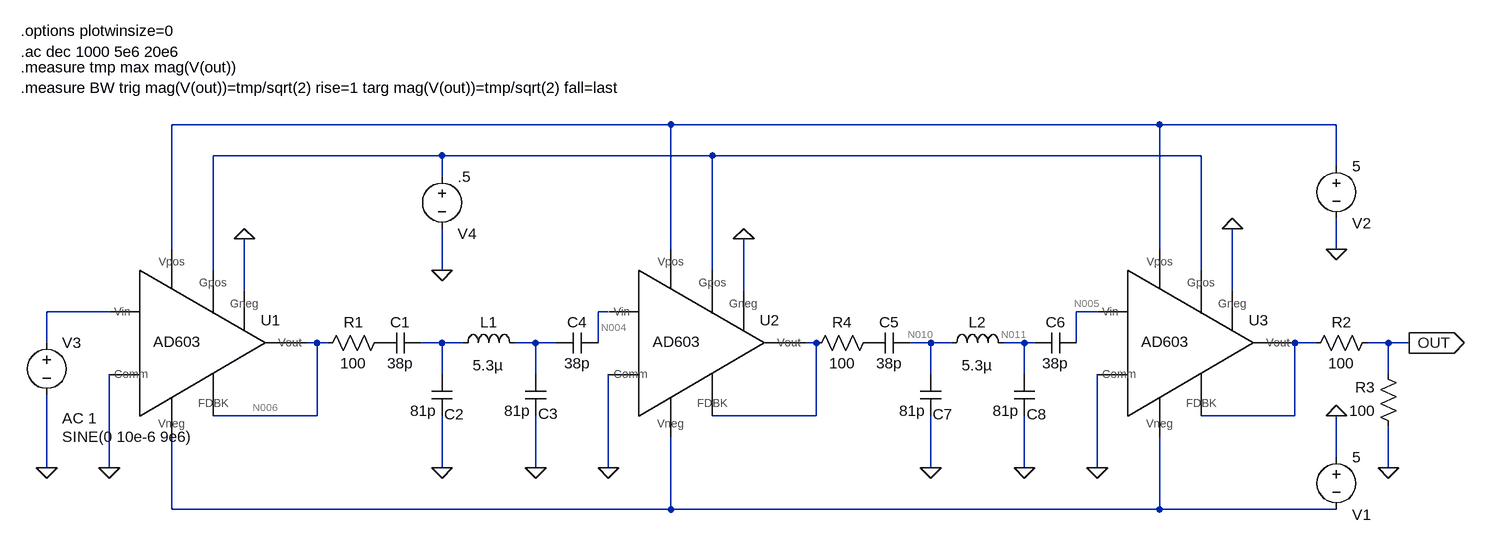
[diagram p0: schematic AD603_IF.asc]
AD603_IF.asc, the LTspice schematic file:
Version 4
SHEET 1 972 680
WIRE -1264 -352 -2032 -352
WIRE -512 -352 -1264 -352
WIRE -240 -352 -512 -352
WIRE -1616 -304 -1968 -304
WIRE -1200 -304 -1616 -304
WIRE -448 -304 -1200 -304
WIRE -240 -288 -240 -352
WIRE -1616 -272 -1616 -304
WIRE -2032 -160 -2032 -352
WIRE -1264 -160 -1264 -352
WIRE -512 -160 -512 -352
WIRE -240 -160 -240 -208
WIRE -1968 -128 -1968 -304
WIRE -1616 -128 -1616 -192
WIRE -1200 -128 -1200 -304
WIRE -448 -128 -448 -304
WIRE -1920 -96 -1920 -176
WIRE -1152 -96 -1152 -176
WIRE -400 -96 -400 -192
WIRE -2128 -64 -2224 -64
WIRE -1360 -64 -1376 -64
WIRE -608 -64 -640 -64
WIRE -2224 -16 -2224 -64
WIRE -1808 -16 -1824 -16
WIRE -1792 -16 -1808 -16
WIRE -1616 -16 -1648 -16
WIRE -1584 -16 -1616 -16
WIRE -1472 -16 -1504 -16
WIRE -1440 -16 -1472 -16
WIRE -1376 -16 -1376 -64
WIRE -1040 -16 -1056 -16
WIRE -864 -16 -896 -16
WIRE -832 -16 -864 -16
WIRE -720 -16 -752 -16
WIRE -704 -16 -720 -16
WIRE -640 -16 -640 -64
WIRE -272 -16 -304 -16
WIRE -160 -16 -192 -16
WIRE -128 -16 -160 -16
WIRE -1616 32 -1616 -16
WIRE -1472 32 -1472 -16
WIRE -864 32 -864 -16
WIRE -720 32 -720 -16
WIRE -160 32 -160 -16
WIRE -1808 96 -1808 -16
WIRE -1808 96 -1968 96
WIRE -1040 96 -1040 -16
WIRE -1040 96 -1200 96
WIRE -304 96 -304 -16
WIRE -304 96 -448 96
WIRE -240 160 -240 96
WIRE -2224 176 -2224 64
WIRE -2128 176 -2128 32
WIRE -1616 176 -1616 96
WIRE -1472 176 -1472 96
WIRE -1360 176 -1360 32
WIRE -864 176 -864 96
WIRE -720 176 -720 96
WIRE -608 176 -608 32
WIRE -160 176 -160 112
WIRE -2032 240 -2032 128
WIRE -1264 240 -1264 128
WIRE -1264 240 -2032 240
WIRE -512 240 -512 128
WIRE -512 240 -1264 240
WIRE -240 240 -512 240
FLAG -2128 176 0
FLAG -240 96 0
FLAG -240 -160 0
FLAG -2224 176 0
FLAG -128 -16 OUT
IOPIN -128 -16 Out
FLAG -1920 -176 0
FLAG -1616 176 0
FLAG -1472 176 0
FLAG -1616 -128 0
FLAG -1152 -176 0
FLAG -160 176 0
FLAG -1360 176 0
FLAG -400 -192 0
FLAG -608 176 0
FLAG -864 176 0
FLAG -720 176 0
SYMBOL voltage -240 144 R0
WINDOW 0 24 104 Left 0
WINDOW 3 24 16 Left 0
WINDOW 123 0 0 Left 0
WINDOW 39 0 0 Left 0
SYMATTR InstName V1
SYMATTR Value 5
SYMBOL voltage -240 -304 R0
WINDOW 0 24 104 Left 0
WINDOW 3 24 16 Left 0
WINDOW 123 0 0 Left 0
WINDOW 39 0 0 Left 0
SYMATTR InstName V2
SYMATTR Value 5
SYMBOL voltage -2224 -32 R0
WINDOW 123 24 132 Left 0
WINDOW 39 0 0 Left 0
WINDOW 3 24 160 Left 0
SYMATTR Value2 AC 1
SYMATTR Value SINE(0 10e-6 9e6)
SYMATTR InstName V3
SYMBOL cap -1648 -32 R90
WINDOW 0 0 32 VBottom 0
WINDOW 3 32 32 VTop 0
SYMATTR InstName C1
SYMATTR Value 38p
SYMBOL cap -1600 96 R180
WINDOW 0 -18 2 Left 0
WINDOW 3 24 8 Left 0
SYMATTR InstName C2
SYMATTR Value 81p
SYMBOL cap -1456 96 R180
WINDOW 0 -19 3 Left 0
WINDOW 3 24 8 Left 0
SYMATTR InstName C3
SYMATTR Value 81p
SYMBOL cap -1440 0 R270
WINDOW 0 32 32 VTop 0
WINDOW 3 0 32 VBottom 0
SYMATTR InstName C4
SYMATTR Value 38p
SYMBOL ind -1600 0 R270
WINDOW 0 32 56 VTop 0
WINDOW 3 -3 55 VBottom 0
SYMATTR InstName L1
SYMATTR Value 5.3µ
SYMBOL res -1696 -32 R90
WINDOW 0 0 56 VBottom 0
WINDOW 3 32 56 VTop 0
SYMATTR InstName R1
SYMATTR Value 100
SYMBOL voltage -1616 -288 R0
WINDOW 0 24 104 Left 0
WINDOW 3 24 16 Left 0
WINDOW 123 0 0 Left 0
WINDOW 39 0 0 Left 0
SYMATTR InstName V4
SYMATTR Value .5
SYMBOL ad603 -2016 -16 R0
WINDOW 3 -44 -2 Left 0
SYMATTR InstName U1
SYMBOL res -144 128 R180
WINDOW 0 36 76 Left 0
WINDOW 3 36 40 Left 0
SYMATTR InstName R3
SYMATTR Value 100
SYMBOL ad603 -1248 -16 R0
WINDOW 3 -44 -2 Left 0
SYMATTR InstName U2
SYMBOL res -176 -32 R90
WINDOW 0 0 56 VBottom 0
WINDOW 3 32 56 VTop 0
SYMATTR InstName R2
SYMATTR Value 100
SYMBOL ad603 -496 -16 R0
WINDOW 3 -44 -2 Left 0
SYMATTR InstName U3
SYMBOL res -944 -32 R90
WINDOW 0 0 56 VBottom 0
WINDOW 3 32 56 VTop 0
SYMATTR InstName R4
SYMATTR Value 100
SYMBOL cap -896 -32 R90
WINDOW 0 0 32 VBottom 0
WINDOW 3 32 32 VTop 0
SYMATTR InstName C5
SYMATTR Value 38p
SYMBOL ind -848 0 R270
WINDOW 0 32 56 VTop 0
WINDOW 3 -3 55 VBottom 0
SYMATTR InstName L2
SYMATTR Value 5.3µ
SYMBOL cap -704 0 R270
WINDOW 0 32 32 VTop 0
WINDOW 3 0 32 VBottom 0
SYMATTR InstName C6
SYMATTR Value 38p
SYMBOL cap -848 96 R180
WINDOW 0 -18 2 Left 0
WINDOW 3 24 8 Left 0
SYMATTR InstName C7
SYMATTR Value 81p
SYMBOL cap -704 96 R180
WINDOW 0 -18 2 Left 0
WINDOW 3 24 8 Left 0
SYMATTR InstName C8
SYMATTR Value 81p
TEXT -2264 -496 Left 0 !.options plotwinsize=0
TEXT -2264 -464 Left 0 !.ac dec 1000 5e6 20e6
TEXT -2264 -440 Left 0 !.measure tmp max mag(V(out))\n.measure BW trig mag(V(out))=tmp/sqrt(2) rise=1 targ mag(V(out))=tmp/sqrt(2) fall=last

The netlist it stands for:
* AD603_IF.asc
V1 0 N013 5
V2 N001 0 5
V3 N003 0 SINE(0 10e-6 9e6) AC 1
C1 N007 P001 38p
C2 0 N007 81p
C3 0 N008 81p
C4 N008 N004 38p
L1 N007 N008 5.3µ
R1 P001 N006 100
V4 N002 0 .5
XU1 N003 0 N001 N013 N006 N002 0 N006 AD603  ; pins Vin Comm Vpos Vneg Vout Gpos Gneg FDBK
R3 0 OUT 100
XU2 N004 0 N001 N013 N009 N002 0 N009 AD603  ; pins Vin Comm Vpos Vneg Vout Gpos Gneg FDBK
R2 OUT N012 100
XU3 N005 0 N001 N013 N012 N002 0 N012 AD603  ; pins Vin Comm Vpos Vneg Vout Gpos Gneg FDBK
R4 P002 N009 100
C5 N010 P002 38p
L2 N010 N011 5.3µ
C6 N011 N005 38p
C7 0 N010 81p
C8 0 N011 81p
.options plotwinsize=0
.ac dec 1000 5e6 20e6
.measure tmp max mag(V(out))
.measure BW trig mag(V(out))=tmp/sqrt(2) rise=1 targ mag(V(out))=tmp/sqrt(2) fall=last
.lib AD603.CIR
.backanno
.end

* Results of the author's LTspice run, read from the files saved beside the schematic
* Operating Point, zero values left out:
*   V(n010) = -8.762e+04 TV
*   V(n011) = -8.762e+04 TV
*   I(C8) = 7.098 µA
*   I(C7) = 7.098 µA
*   I(C6) = -3.33 µA
*   I(C5) = -3.33 µA
*   I(R4) = -3.33 µA
*   I(R2) = 50.68 µA
*   I(R3) = 50.68 µA
*   I(V4) = -645 nA
*   I(V3) = -5.79 µA
*   I(V2) = -50.99 mA
*   I(V1) = -51.06 mA
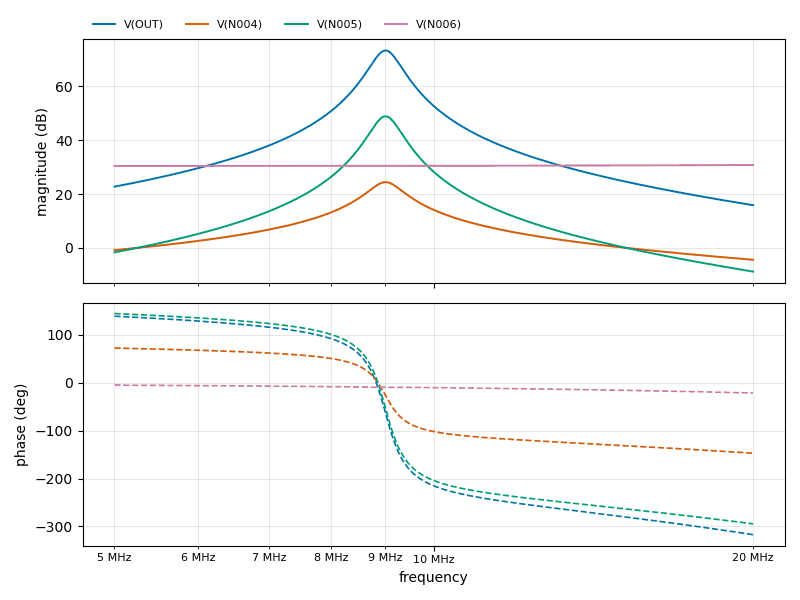
[diagram p1: AC Analysis of AD603_IF.asc, plotted from the saved traces]
* AC Analysis, 1 run:
*   V(OUT): 22.76 dB at 5 MHz, 15.88 dB at 20 MHz, peak 73.36 dB at 9.015 MHz, 3 dB below the peak at 8.813 MHz and 9.203 MHz
*   V(N004): -0.83 dB at 5 MHz, -4.40 dB at 20 MHz, peak 24.45 dB at 9.015 MHz, 3 dB below the peak at 8.707 MHz and 9.314 MHz
*   V(N005): -1.65 dB at 5 MHz, -8.80 dB at 20 MHz, peak 48.90 dB at 9.015 MHz, 3 dB below the peak at 8.813 MHz and 9.203 MHz
*   V(N006): 30.45 dB at 5 MHz, 30.81 dB at 20 MHz, peak 30.81 dB at 20 MHz